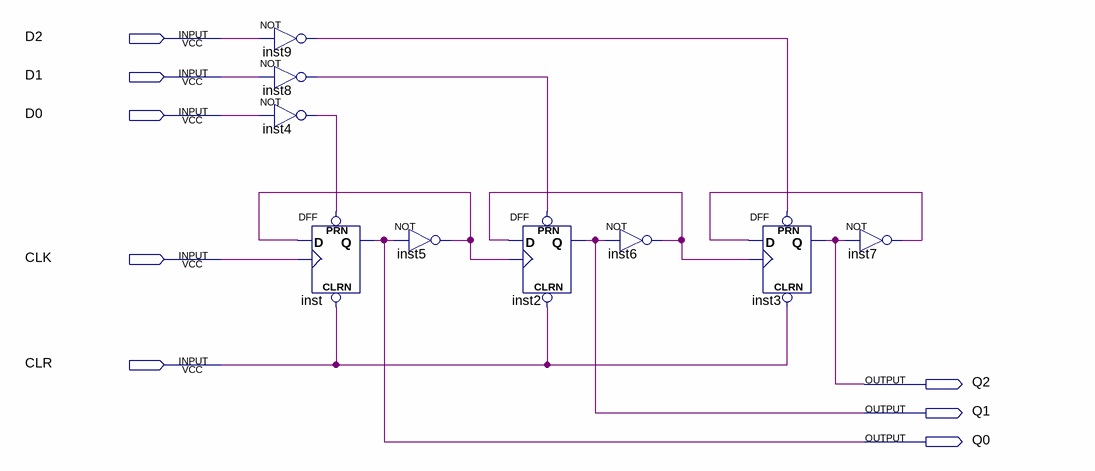
[diagram p0: schematic sheet]
// Quartus schematic ripple_counter_8_with_input.bdf as structural Verilog: 9 symbols, 8 pins
module ripple_counter_8_with_input (
  input  D2,
  input  D1,
  input  D0,
  input  CLK,
  input  CLR,
  output Q2,
  output Q1,
  output Q0
);

  wire inst4_out, inst5_out, inst6_out, inst7_out, inst8_out, inst9_out;

  not inst9 (inst9_out, D2);
  not inst8 (inst8_out, D1);
  not inst4 (inst4_out, D0);
  DFF inst (.CLRN(CLR), .CLK(CLK), .D(inst5_out), .PRN(inst4_out), .Q(Q0));
  not inst5 (inst5_out, Q0);
  DFF inst2 (.CLRN(CLR), .CLK(inst5_out), .D(inst6_out), .PRN(inst8_out), .Q(Q1));
  not inst6 (inst6_out, Q1);
  DFF inst3 (.CLRN(CLR), .CLK(inst6_out), .D(inst7_out), .PRN(inst9_out), .Q(Q2));
  not inst7 (inst7_out, Q2);
endmodule
